# Altium project Sitara.PrjPCB (part 1 of 2)
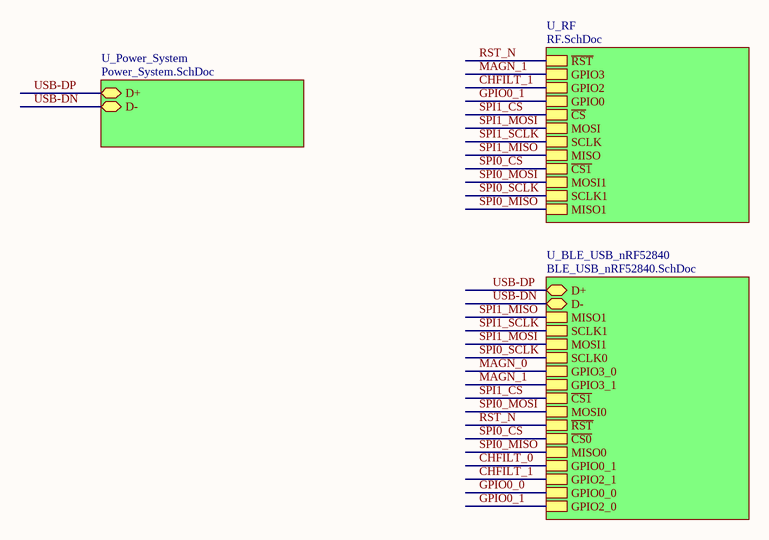
[diagram p0: _Block_level_sheet.SchDoc]
4 sheets, 109 parts. Net scope: hierarchical (ports join the sheet entries above them; power ports are global).
Board files: sitara_rev1.PcbDoc, sitara_rev2.PcbDoc, sitara_rev3.PcbDoc, sitara_rev3b.PcbDoc
Sheets:
  _Block_level_sheet.SchDoc
    U_Power_System = Power_System.SchDoc
    U_BLE_USB_nRF52840 = BLE_USB_nRF52840.SchDoc
    U_RF = RF.SchDoc

## Sheet _Block_level_sheet.SchDoc: Sitara
size A4; CompanyName: SPAN; Engineer: Goverdhan; Organization: University of Utah; Address1: 50 S Central Campus Dr; Address2: MEB Rm 3129; Address3: Salt Lake City, Utah 84115; Address4: USA; Revision: 1; SheetNumber: 1; SheetTotal: 4

### Sub-sheets
U_BLE_USB_nRF52840 = BLE_USB_nRF52840.SchDoc: D+ (bidir), D- (bidir), MISO1, SCLK1, MOSI1, SCLK0, GPIO3_0, GPIO3_1, ~{CS1}, MOSI0, ~{RST}, ~{CS0}, MISO0, GPIO0_1, GPIO2_1, GPIO0_0, GPIO2_0
U_Power_System = Power_System.SchDoc: D+ (bidir), D- (bidir)
U_RF = RF.SchDoc: ~{CS1}, MISO1, MOSI1, SCLK1, GPIO3, GPIO2, MISO, GPIO0, ~{CS}, ~{RST}, SCLK, MOSI

### Nets
CHFILT_1: sheet U_BLE_USB_nRF52840/GPIO2_1, sheet U_RF/GPIO2
GPIO0_1: sheet U_BLE_USB_nRF52840/GPIO2_0, sheet U_RF/GPIO0
MAGN_1: sheet U_BLE_USB_nRF52840/GPIO3_1, sheet U_RF/GPIO3
RST_N: sheet U_BLE_USB_nRF52840/~{RST}, sheet U_RF/~{RST}
SPI0_CS: sheet U_BLE_USB_nRF52840/~{CS0}, sheet U_RF/~{CS1}
SPI0_MISO: sheet U_BLE_USB_nRF52840/MISO0, sheet U_RF/MISO1
SPI0_MOSI: sheet U_BLE_USB_nRF52840/MOSI0, sheet U_RF/MOSI1
SPI0_SCLK: sheet U_BLE_USB_nRF52840/SCLK0, sheet U_RF/SCLK1
SPI1_CS: sheet U_BLE_USB_nRF52840/~{CS1}, sheet U_RF/~{CS}
SPI1_MISO: sheet U_BLE_USB_nRF52840/MISO1, sheet U_RF/MISO
SPI1_MOSI: sheet U_BLE_USB_nRF52840/MOSI1, sheet U_RF/MOSI
SPI1_SCLK: sheet U_BLE_USB_nRF52840/SCLK1, sheet U_RF/SCLK
USB-DN: sheet U_Power_System/D-, sheet U_BLE_USB_nRF52840/D-  [project net D1_N]
USB-DP: sheet U_Power_System/D+, sheet U_BLE_USB_nRF52840/D+  [project net D1_P]

### Notes on the sheet
- Title
- Designed by:
- Date:
- Time:
- Revision:
- Sheet
- of
- File:

## Sheet Power_System.SchDoc
size A4; CompanyName: SPAN; Engineer: Goverdhan; Organization: University of Utah; Address1: 50 S Central Campus Dr; Address2: MEB Rm 3129; Address3: Salt Lake City, Utah 84115; Address4: USA; Revision: 1; SheetNumber: 2; SheetTotal: 4
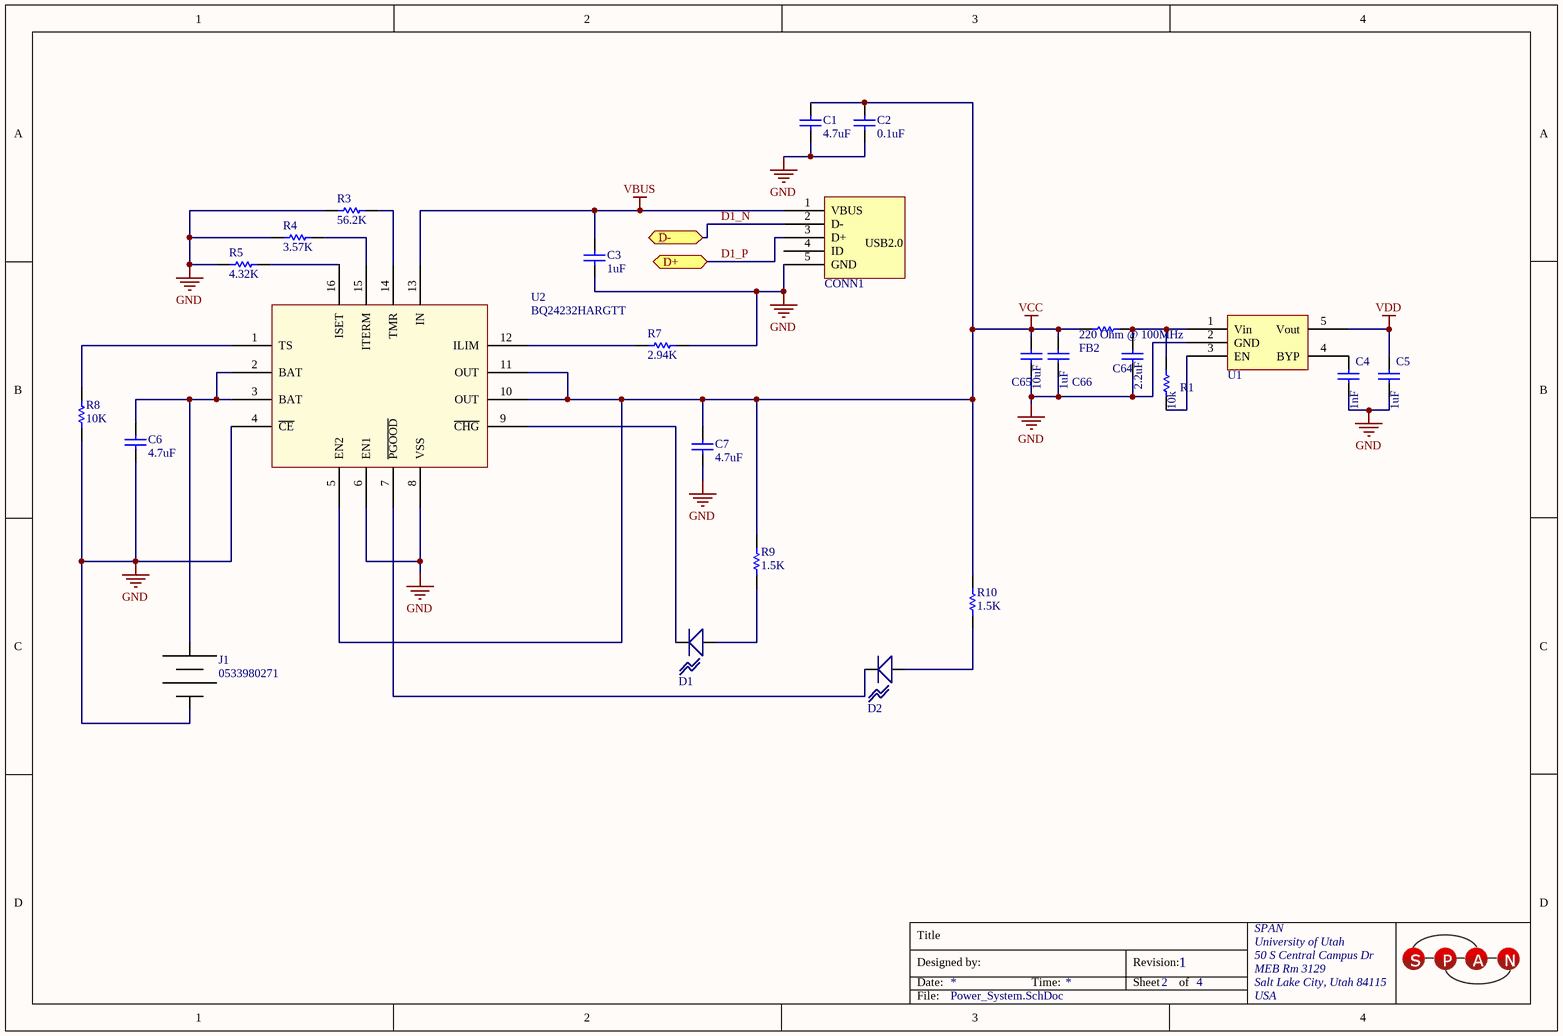
[diagram p1: Power_System.SchDoc]

### Parts
C1  4.7uF  [0603_Cap]
C2  0.1uF  [0603_Cap]
C3  1uF  [0603_Cap]
C4  10uF  [0603_Cap]  (value not drawn)
C5  GRM188R61A105KA61D  [CAPC1608X08N (0603)]  (value not drawn)
C6  4.7uF  [0603_Cap]
C7  4.7uF  [0603_Cap]
C64  GRM188F51A225ZE01D  [CAPC1608X08N (0603)]  (value not drawn)
C65  GRM188R60J106ME47D  [CAPC1608X08N (0603)]  (value not drawn)
C66  GRM188R61A105KA61D  [CAPC1608X08N (0603)]  (value not drawn)
CONN1  10118193-0001LF  [USB_micro_B]  (value not drawn)
D1  LTST-C191KFKT  [0603_LED]  (value not drawn)
D2  LTST-C191KFKT  [0603_LED]  (value not drawn)
FB2  BLM18BD221SN1D  [RESC1608X06N (0603)]  (value not drawn)
J1  0533980271  [53398-0271]
R1  10K  [0603_RES]  (value not drawn)
R3  56.2K  [0603_RES]
R4  3.57K  [0603_RES]
R5  4.32K  [0603_RES]
R7  2.94K  [0603_RES]
R8  10K  [0603_RES]
R9  1.5K  [0603_RES]
R10  1.5K  [0603_RES]
U1  TPS2147IDGQG4  [SOT95P280X145-5N]  (value not drawn)
U2  BQ24232HARGTT  [QFN_16_BQ24232]

### Ports
D+ (bidir), D- (bidir)

### Nets
GND: C1.1 C2.1 C3.1 C4.1 C5.1 C6.1 C7.1 C64.1 C65.1 C66.1 CONN1.5(GND) J1.2(Neg) R3.1 R4.1 R5.1 R7.2 R8.1 U1.2(GND) U2.4(~{CE}) U2.6(EN1) U2.8(VSS)
VBUS: C3.2 CONN1.1(VBUS) U2.13(IN)
VCC: C1.2 C2.2 C7.2 C65.2 C66.2 FB2.1 R9.2 R10.2 U2.5(EN2) U2.10(OUT) U2.11(OUT)
VDD: C5.2 U1.5(Vout)
D1_N: CONN1.2(D-) ; port D-
D1_P: CONN1.3(D+) ; port D+
NetC4_2: C4.2 U1.4(BYP)
NetC6_2: C6.2 J1.1(Pos) U2.2(BAT) U2.3(BAT)
NetC64_2: C64.2 FB2.2 R1.2 U1.1(Vin)
NetD1_1: D1.1 R9.1
NetD1_2: D1.2 U2.9(~{CHG})
NetD2_1: D2.1 R10.1
NetD2_2: D2.2 U2.7(~{PGOOD})
NetR1_1: R1.1 U1.3(EN)
NetR3_2: R3.2 U2.14(TMR)
NetR4_2: R4.2 U2.15(ITERM)
NetR5_2: R5.2 U2.16(ISET)
NetR7_1: R7.1 U2.12(ILIM)
NetR8_2: R8.2 U2.1(TS)

Not connected (* = marked no-connect by the designer): CONN1 4(ID)

### Notes on the sheet
- Title
- Designed by:
- Date:
- Time:
- Revision:
- Sheet
- of
- File:
- (in symbol 10118193-0001LF) USB2.0
- (in symbol GRM188F51A225ZE01D) 2.2uF
- (in symbol GRM188R60J106ME47D) 10uF
- (in symbol GRM188R61A105KA61D) 1uF
- (in symbol GRM1885C1H102JA01D) 1nF

### Library data of the parts
C1 C6 C7 = JMK107BJ475MAHT: Manufacturer: Taiyo Yuden; Capacitance: 4.7µF; Tolerance: ±20%; Voltage - Rated: 6.3V; Temperature Coefficient: X5R; Supplier 1: Digi-Key; Manufacturer Part Number: JMK107BJ475MAHT; RoHS: RoHS Compliant; Category: Capacitors; Stock 1: 4000; Pricing 1: 4000=0.03053, 8000=0.0284, 12000=0.02698, 28000=0.02556, 100000=0.01935 (USD); Packaging: Tape & Reel (TR); Part Status: Active; Operating Temperature: -55°C ~ 85°C; Features: -; Ratings: AEC-Q200; Applications: Automotive, SMPS Filtering; Failure Rate: -; Mounting Type: Surface Mount, MLCC; Package / Case: 0603 (1608 Metric); Size / Dimension: 0.063" L x 0.031" W (1.60mm x 0.80mm); Height - Seated (Max): -; Thickness (Max): 0.035" (0.90mm); Lead Spacing: -; Lead Style: -; ComponentLink1URL: http://www.yuden.co.jp/productdata/catalog/en/mlcc_all_hq_e.pdf; ComponentLink1Description: http://www.yuden.co.jp/productdata/catalog/en/mlcc_all_hq_e.pdf; Supplier Part Number 1: 587-4903-2-ND
C2 = 0603YC104KAT4A: CAP CER 0.1UF 16V X7R 0603; Manufacturer: AVX Corporation; Capacitance: 0.1µF; Tolerance: ±10%; Supplier 1: Digi-Key; Manufacturer Part Number: 0603YC104KAT4A; RoHS: RoHS Compliant; Category: Capacitors; Stock 1: 15000; Pricing 1: 15000=0.00344, 30000=0.00327, 75000=0.00292, 105000=0.00237 (USD); Packaging: Tape & Reel (TR); Part Status: Active; Voltage - Rated: 16V; Temperature Coefficient: X7R; Operating Temperature: -55°C ~ 125°C; Features: -; Ratings: -; Applications: General Purpose; Failure Rate: -; Mounting Type: Surface Mount, MLCC; Package / Case: 0603 (1608 Metric); Size / Dimension: 0.063" L x 0.032" W (1.60mm x 0.81mm); Height - Seated (Max): -; Thickness (Max): 0.035" (0.90mm); Lead Spacing: -; Lead Style: -; ComponentLink1URL: http://datasheets.avx.com/X7RDielectric.pdf; ComponentLink1Description: http://datasheets.avx.com/X7RDielectric.pdf; Supplier Part Number 1: 478-10054-2-ND
C3 = JMK107C6105KA-T: CAP CER 1uF SMD; Manufacturer: Taiyo Yuden; Capacitance: 1µF; Tolerance: ±10%; Voltage - Rated: 6.3V; Temperature Coefficient: X6S; Supplier 1: Digi-Key; Manufacturer Part Number: JMK107C6105KA-T; RoHS: RoHS Compliant; Category: Capacitors; Stock 1: 8000; Pricing 1: 4000=0.02281, 8000=0.02122, 12000=0.02016, 28000=0.0191, 100000=0.01446 (USD); Packaging: Tape & Reel (TR); Part Status: Active; Operating Temperature: -55°C ~ 105°C; Features: -; Ratings: -; Applications: SMPS Filtering; Failure Rate: -; Mounting Type: Surface Mount, MLCC; Package / Case: 0603 (1608 Metric); Size / Dimension: 0.063" L x 0.031" W (1.60mm x 0.80mm); Height - Seated (Max): -; Thickness (Max): 0.035" (0.90mm); Lead Spacing: -; Lead Style: -; ComponentLink1URL: http://www.yuden.co.jp/productdata/catalog/en/mlcc_all_e.pdf; ComponentLink1Description: http://www.yuden.co.jp/productdata/catalog/en/mlcc_all_e.pdf; Supplier Part Number 1: 587-4904-2-ND
C4 = GRM1885C1H102JA01D: CAP CER 1000PF 50V 5% NP0 0603; Manufacturer: Murata Electronics North America; Temperature Coefficient: C0G, NP0; Supplier 1: Digi-Key; Manufacturer Part Number: GRM1885C1H102JA01D; RoHS: RoHS Compliant; Category: Capacitors; Stock 1: 140000; Pricing 1: 4000=0.00863, 8000=0.00788, 12000=0.0075, 28000=0.00713, 100000=0.00516 (USD); Packaging: Tape & Reel (TR); Capacitance: 1000pF; Voltage - Rated: 50V; Tolerance: ±5%; Mounting Type: Surface Mount, MLCC; Operating Temperature: -55°C ~ 125°C; Applications: General Purpose; Ratings: -; Package / Case: 0603 (1608 Metric); Size / Dimension: 0.063" L x 0.031" W (1.60mm x 0.80mm); Height - Seated (Max): -; Thickness (Max): 0.035" (0.90mm); Lead Spacing: -; Features: -; Lead Style: -; ComponentLink1URL: http://www.murata.com/products/catalog/pdf/c02e.pdf; ComponentLink1Description: http://www.murata.com/products/catalog/pdf/c02e.pdf
C5 C66 = GRM188R61A105KA61D: CAP CER 1UF 10V 10% X5R 0603; Manufacturer: Murata Electronics North America; Capacitance: 1.0µF; Supplier 1: Digi-Key; Manufacturer Part Number: GRM188R61A105KA61D; RoHS: RoHS Compliant; Category: Capacitors; Stock 1: 244919; Pricing 1: 1=0.1, 10=0.041, 50=0.0224, 100=0.019, 250=0.01552, 500=0.01328, 1000=0.01035 (USD); Packaging: Cut Tape (CT); Voltage - Rated: 10V; Tolerance: ±10%; Temperature Coefficient: X5R; Mounting Type: Surface Mount, MLCC; Operating Temperature: -55°C ~ 85°C; Applications: General Purpose; Ratings: -; Package / Case: 0603 (1608 Metric); Size / Dimension: 0.063" L x 0.031" W (1.60mm x 0.80mm); Height - Seated (Max): -; Thickness (Max): 0.035" (0.90mm); Lead Spacing: -; Features: -; Lead Style: -; ComponentLink1URL: http://search.murata.co.jp/Ceramy/image/img/A01X/G101/ENG/GRM188R61A105KA61-01.pdf; ComponentLink1Description: http://search.murata.co.jp/Ceramy/image/img/A01X/G101/ENG/GRM188R61A105KA61-01.pdf
C64 = GRM188F51A225ZE01D: CAP CER 2.2UF 10V Y5V 0603; Manufacturer: Murata Electronics North America; Capacitance: 2.2µF; Tolerance: -20%, +80%; Temperature Coefficient: Y5V (F); Supplier 1: Digi-Key; Manufacturer Part Number: GRM188F51A225ZE01D; RoHS: RoHS Compliant; Category: Capacitors; Stock 1: 8000; Pricing 1: 4000=0.02043, 8000=0.019, 12000=0.01805, 28000=0.0171 (USD); Packaging: Tape & Reel (TR); Voltage - Rated: 10V; Mounting Type: Surface Mount, MLCC; Operating Temperature: -30°C ~ 85°C; Applications: General Purpose; Ratings: -; Package / Case: 0603 (1608 Metric); Size / Dimension: 0.063" L x 0.031" W (1.60mm x 0.80mm); Height - Seated (Max): -; Thickness (Max): 0.035" (0.90mm); Lead Spacing: -; Features: -; Lead Style: -; ComponentLink1URL: http://search.murata.co.jp/Ceramy/image/img/A01X/G101/ENG/GRM188F51A225ZE01-01.pdf; ComponentLink1Description: http://search.murata.co.jp/Ceramy/image/img/A01X/G101/ENG/GRM188F51A225ZE01-01.pdf
C65 = GRM188R60J106ME47D: CAP CER 10UF 6.3V 20% X5R 0603; Manufacturer: Murata Electronics North America; Capacitance: 10µF; Supplier 1: Digi-Key; Manufacturer Part Number: GRM188R60J106ME47D; RoHS: RoHS Compliant; Category: Capacitors; Stock 1: 2128324; Pricing 1: 1=0.24, 10=0.2, 50=0.1126, 100=0.1, 250=0.075, 500=0.06626, 1000=0.05875 (USD); Packaging: Digi-Reel®; Voltage - Rated: 6.3V; Tolerance: ±20%; Temperature Coefficient: X5R; Mounting Type: Surface Mount, MLCC; Operating Temperature: -55°C ~ 85°C; Applications: General Purpose; Ratings: -; Package / Case: 0603 (1608 Metric); Size / Dimension: 0.063" L x 0.031" W (1.60mm x 0.80mm); Height - Seated (Max): -; Thickness (Max): 0.035" (0.90mm); Lead Spacing: -; Features: -; Lead Style: -; ComponentLink1URL: http://search.murata.co.jp/Ceramy/image/img/A01X/G101/ENG/GRM188R60J106ME47-01.pdf; ComponentLink1Description: http://search.murata.co.jp/Ceramy/image/img/A01X/G101/ENG/GRM188R60J106ME47-01.pdf; Supplier 2: Digi-Key
CONN1 = 10118193-0001LF: CONN USB MICRO B RECPT SMT R/A; Manufacturer: Amphenol FCI; Connector Type: USB - micro B; Number of Contacts: 5; Gender: Receptacle; Specifications: USB 2.0; Number of Ports: 1; Current Rating: 1.8A per Contact; Voltage - Rated: 100VAC; Mating Cycles: 10000; Shielding: Shielded; Material Flammability Rating: UL94 V-0; Supplier 1: Digi-Key; Manufacturer Part Number: 10118193-0001LF; RoHS: RoHS Compliant; Category: Connectors, Interconnects; Stock 1: 88800; Pricing 1: 1200=0.19845, 2400=0.18144, 6000=0.1701, 8400=0.15876, 12000=0.15309, 30000=0.15082, 60000=0.14742 (USD); Packaging: Tape & Reel (TR); Part Status: Active; Mounting Type: Surface Mount, Right Angle; Through Hole; Mounting Feature: Horizontal; Termination: Solder; Features: Solder Retention; Ingress Protection: -; Operating Temperature: -30°C ~ 80°C; Contact Finish: Gold; Shell/Shielding Material: Steel, Stainless; Insulation Color: Black; ComponentLink1URL: http://portal.fciconnect.com/Comergent//fci/drawing/10118193.pdf; ComponentLink1Description: http://portal.fciconnect.com/Comergent//fci/drawing/10118193.pdf; Supplier Part Number 1: 609-4616-2-ND
D1 D2 = LTST-C191KFKT: LED ORANGE CLEAR 0603 SMD; Manufacturer: Lite-On Inc.; Lens Color: Colorless; Millicandela Rating: 90mcd; Lens Style/Size: Rectangle with Flat Top, 1.10mm x 0.80mm; Voltage - Forward (Vf) (Typ): 2V; Current - Test: 20mA; Viewing Angle: 130°; Wavelength - Dominant: 605nm; Wavelength - Peak: 611nm; Supplier 1: Digi-Key; Manufacturer Part Number: LTST-C191KFKT; RoHS: RoHS Compliant; Category: Optoelectronics; Stock 1: 160000; Pricing 1: 5000=0.0376, 10000=0.03384, 25000=0.03008, 50000=0.02726, 125000=0.02538 (USD); Packaging: Tape & Reel (TR); Part Status: Active; Color: Orange; Lens Transparency: Clear; Mounting Type: Surface Mount; Features: -; Package / Case: 0603 (1608 Metric); Size / Dimension: 1.60mm L x 0.80mm W; Height (Max): 0.55mm; ComponentLink1URL: http://optoelectronics.liteon.com/upload/download/DS22-2000-222/S_110_LTST-C191KFKT.pdf; ComponentLink1Description: http://optoelectronics.liteon.com/upload/download/DS22-2000-222/S_110_LTST-C191KFKT.pdf; Supplier Part Number 1: 160-1445-2-ND
FB2 = BLM18BD221SN1D: FERRITE CHIP 220 OHM 200MA 0603; Manufacturer: Murata Electronics North America; Impedance @ Frequency: 220 Ohm @ 100MHz; DC Resistance (DCR): 450 mOhm Max; Filter Type: Differential Mode - Single; Supplier 1: Digi-Key; Manufacturer Part Number: BLM18BD221SN1D; RoHS: RoHS Compliant; Category: Filters; Stock 1: 35645; Pricing 1: 1=0.1, 10=0.087, 50=0.0712, 100=0.0523, 250=0.038, 500=0.03484, 1000=0.0301 (USD); Packaging: Cut Tape (CT); Current Rating: 200mA; Package / Case: 0603 (1608 Metric); Mounting Type: Surface Mount; Height (Max): 0.037" (0.95mm); Size / Dimension: 0.063" L x 0.031" W (1.60mm x 0.80mm); ComponentLink1URL: http://search.murata.co.jp/Ceramy/image/img/PDF/ENG/L0110S0100BLM18B.pdf; ComponentLink1Description: http://search.murata.co.jp/Ceramy/image/img/PDF/ENG/L0110S0100BLM18B.pdf
J1 = 0533980271: CONN HEADER 2POS 1.25MM VERT SMD; Manufacturer: Molex Inc; Connector Type: Header, Male Blades; Number of Positions: 2; Pitch: 0.049" (1.25mm); Supplier 1: Digi-Key; RoHS: RoHS Compliant; Category: Connectors, Interconnects; Stock 1: 14126; Pricing 1: 1=1.4, 10=1.091, 25=1.0168, 50=0.923, 100=0.8323, 250=0.7014, 500=0.66448 (USD); Connector Style: -; Mounting Type: Surface Mount; Termination: Solder; Wire Gauge: -; Features: -; Color: Natural; Packaging: Cut Tape (CT); ComponentLink1URL: http://www.molex.com/pdm_docs/sd/533980271_sd.pdf; ComponentLink1Description: http://www.molex.com/pdm_docs/sd/533980271_sd.pdf; Supplier Part Number 1: WM7606CT-ND; Manufacturer Part Number: 0533980271
R1 = RC0603FR-0710KL: RES 10.0K OHM 1/10W 1% 0603 SMD; Manufacturer: Yageo; Power (Watts): 0.1W, 1/10W; Temperature Coefficient: ±100ppm/°C; Supplier 1: Digi-Key; Manufacturer Part Number: RC0603FR-0710KL; RoHS: RoHS Compliant; Category: Resistors; Stock 1: 11245000; Pricing 1: 5000=0.00171, 10000=0.00149, 25000=0.00131, 50000=0.0012, 125000=0.00117 (USD); Packaging: Tape & Reel (TR); Resistance (Ohms): 10k; Tolerance: ±1%; Composition: Thick Film; Features: -; Package / Case: 0603 (1608 Metric); Supplier Device Package: 0603; Size / Dimension: 0.063" L x 0.031" W (1.60mm x 0.80mm); Height: 0.022" (0.55mm); Number of Terminations: 2; ComponentLink1URL: http://www.yageo.com/documents/recent/PYu-RC0603_51_RoHS_L_4.pdf; ComponentLink1Description: http://www.yageo.com/documents/recent/PYu-RC0603_51_RoHS_L_4.pdf
R3 = ERA-3AEB5622V: RES SMD 56.2KOHM 0.1% 1/10W 0603; Manufacturer: Panasonic Electronic Components; Power (Watts): 0.1W, 1/10W; Temperature Coefficient: ±25ppm/°C; Supplier 1: Digi-Key; Manufacturer Part Number: ERA-3AEB5622V; RoHS: RoHS Compliant; Category: Resistors; Stock 1: 5000; Pricing 1: 5000=0.0354, 10000=0.03304, 25000=0.03139, 50000=0.03075, 125000=0.03009 (USD); Packaging: Tape & Reel (TR); Part Status: Active; Resistance (Ohms): 56.2k; Tolerance: ±0.1%; Composition: Thin Film; Features: Automotive AEC-Q200; Operating Temperature: -55°C ~ 155°C; Package / Case: 0603 (1608 Metric); Supplier Device Package: 0603; Size / Dimension: 0.063" L x 0.031" W (1.60mm x 0.80mm); Height - Seated (Max): 0.022" (0.55mm); Number of Terminations: 2; Failure Rate: -; ComponentLink1URL: https://industrial.panasonic.com/cdbs/www-data/pdf/RDA0000/AOA0000C237.pdf; ComponentLink1Description: https://industrial.panasonic.com/cdbs/www-data/pdf/RDA0000/AOA0000C237.pdf; Supplier Part Number 1: P56.2KDBTR-ND
R4 = TNPW06033K57BEEA: RES SMD 3.57KOHM 0.1% 1/10W 0603; Manufacturer: Vishay Dale; Power (Watts): 0.1W, 1/10W; Temperature Coefficient: ±25ppm/°C; Supplier 1: Digi-Key; Manufacturer Part Number: TNPW06033K57BEEA; RoHS: RoHS Compliant; Category: Resistors; Stock 1: 0; Pricing 1: 5000=0.1064 (USD); Packaging: Tape & Reel (TR); Part Status: Active; Resistance (Ohms): 3.57k; Tolerance: ±0.1%; Composition: Thin Film; Features: Anti-Sulfur, Automotive AEC-Q200, Moisture Resistant; Operating Temperature: -55°C ~ 125°C; Package / Case: 0603 (1608 Metric); Supplier Device Package: 0603; Size / Dimension: 0.063" L x 0.033" W (1.60mm x 0.85mm); Height - Seated (Max): 0.022" (0.55mm); Number of Terminations: 2; Failure Rate: -; ComponentLink1URL: http://www.vishay.com/docs/28758/tnpw_e3.pdf; ComponentLink1Description: http://www.vishay.com/docs/28758/tnpw_e3.pdf; Supplier Part Number 1: TNPW06033K57BEEA-ND
R5 = ERA-3AEB4321V: RES SMD 4.32KOHM 0.1% 1/10W 0603; Manufacturer: Panasonic Electronic Components; Power (Watts): 0.1W, 1/10W; Temperature Coefficient: ±25ppm/°C; Supplier 1: Digi-Key; Manufacturer Part Number: ERA-3AEB4321V; RoHS: RoHS Compliant; Category: Resistors; Stock 1: 5000; Pricing 1: 5000=0.0354, 10000=0.03304, 25000=0.03139, 50000=0.03075, 125000=0.03009 (USD); Packaging: Tape & Reel (TR); Part Status: Active; Resistance (Ohms): 4.32k; Tolerance: ±0.1%; Composition: Thin Film; Features: Automotive AEC-Q200; Operating Temperature: -55°C ~ 155°C; Package / Case: 0603 (1608 Metric); Supplier Device Package: 0603; Size / Dimension: 0.063" L x 0.031" W (1.60mm x 0.80mm); Height - Seated (Max): 0.022" (0.55mm); Number of Terminations: 2; Failure Rate: -; ComponentLink1URL: https://industrial.panasonic.com/cdbs/www-data/pdf/RDA0000/AOA0000C237.pdf; ComponentLink1Description: https://industrial.panasonic.com/cdbs/www-data/pdf/RDA0000/AOA0000C237.pdf; Supplier Part Number 1: P4.32KDBTR-ND
R7 = ERA-3AEB2941V: RES SMD 2.94KOHM 0.1% 1/10W 0603; Manufacturer: Panasonic Electronic Components; Power (Watts): 0.1W, 1/10W; Temperature Coefficient: ±25ppm/°C; Supplier 1: Digi-Key; Manufacturer Part Number: ERA-3AEB2941V; RoHS: RoHS Compliant; Category: Resistors; Stock 1: 10000; Pricing 1: 5000=0.0354, 10000=0.03304, 25000=0.03139, 50000=0.03075, 125000=0.03009 (USD); Packaging: Tape & Reel (TR); Part Status: Active; Resistance (Ohms): 2.94k; Tolerance: ±0.1%; Composition: Thin Film; Features: Automotive AEC-Q200; Operating Temperature: -55°C ~ 155°C; Package / Case: 0603 (1608 Metric); Supplier Device Package: 0603; Size / Dimension: 0.063" L x 0.031" W (1.60mm x 0.80mm); Height - Seated (Max): 0.022" (0.55mm); Number of Terminations: 2; Failure Rate: -; ComponentLink1URL: https://industrial.panasonic.com/cdbs/www-data/pdf/RDA0000/AOA0000C237.pdf; ComponentLink1Description: https://industrial.panasonic.com/cdbs/www-data/pdf/RDA0000/AOA0000C237.pdf; Supplier Part Number 1: P2.94KDBTR-ND
R8 = PHT0603Y1002BGT200: RES SMD 10KOHM 0.1% 0.0375W 0603; Manufacturer: Vishay Sfernice; Temperature Coefficient: ±15ppm/°C; Supplier 1: Digi-Key; Manufacturer Part Number: PHT0603Y1002BGT200; RoHS: RoHS Compliant; Category: Resistors; Stock 1: 400; Pricing 1: 200=6.6496, 400=6.0262, 600=5.6106, 1000=5.195 (USD); Packaging: Tape & Reel (TR); Part Status: Active; Resistance (Ohms): 10k; Tolerance: ±0.1%; Power (Watts): 0.0375W; Composition: Thin Film; Features: Anti-Sulfur; Operating Temperature: -55°C ~ 215°C; Package / Case: 0603 (1608 Metric); Supplier Device Package: 0603; Size / Dimension: 0.060" L x 0.033" W (1.52mm x 0.85mm); Height - Seated (Max): 0.025" (0.64mm); Number of Terminations: 2; Failure Rate: -; ComponentLink1URL: http://www.vishay.com/docs/53050/pht.pdf; ComponentLink1Description: http://www.vishay.com/docs/53050/pht.pdf; Supplier Part Number 1: PHTB-10KTR-ND
R9 R10 = CRCW06031K50JNEA: RES SMD 1.5K OHM 5% 1/10W 0603; Manufacturer: Vishay Dale; Power (Watts): 0.1W, 1/10W; Temperature Coefficient: ±200ppm/°C; Supplier 1: Digi-Key; Manufacturer Part Number: CRCW06031K50JNEA; RoHS: RoHS Compliant; Category: Resistors; Stock 1: 30000; Pricing 1: 5000=0.00266, 10000=0.00231, 25000=0.00203, 50000=0.0019 (USD); Packaging: Tape & Reel (TR); Part Status: Active; Resistance (Ohms): 1.5k; Tolerance: ±5%; Composition: Thick Film; Features: Automotive AEC-Q200; Operating Temperature: -55°C ~ 155°C; Package / Case: 0603 (1608 Metric); Supplier Device Package: 0603; Size / Dimension: 0.063" L x 0.033" W (1.60mm x 0.85mm); Height - Seated (Max): 0.020" (0.50mm); Number of Terminations: 2; Failure Rate: -; ComponentLink1URL: http://www.vishay.com/docs/20035/dcrcwe3.pdf; ComponentLink1Description: http://www.vishay.com/docs/20035/dcrcwe3.pdf; Supplier Part Number 1: 541-1.5KGTR-ND
U1 = FAN2500S30X: IC REG LDO 3V 0.1A SOT23-5; Manufacturer: Fairchild Semiconductor; Regulator Topology: Positive Fixed; Current - Output: 100mA; Voltage - Dropout (Typical): 0.1V @ 100mA; Number of Regulators: 1; Voltage - Input: Up to 6.5V; Supplier 1: Digi-Key; Manufacturer Part Number: FAN2500S30X; RoHS: RoHS Compliant; Category: Integrated Circuits (ICs); Stock 1: 6000; Pricing 1: 3000=0.25462, 6000=0.23706, 15000=0.22828, 30000=0.2195, 75000=0.21599, 150000=0.21072 (USD); Packaging: Tape & Reel (TR); Voltage - Output: 3V; Current - Limit (Min): -; Operating Temperature: -40°C ~ 125°C; Mounting Type: Surface Mount; Package / Case: SC-74A, SOT-753; Supplier Device Package: SOT-23-5; ComponentLink1URL: http://www.fairchildsemi.com/ds/FA/FAN2500.pdf; ComponentLink1Description: http://www.fairchildsemi.com/ds/FA/FAN2500.pdf
U2 = BQ24232HARGTT: IC LI-ION CHARGE PWR MGMT 16VQFN; Manufacturer: Texas Instruments; Battery Chemistry: Lithium-Ion; Number of Cells: 1; Current - Charging: Constant - Programmable; Programmable Features: Current, Timer; Fault Protection: Over Temperature, Over Voltage, Reverse Current, Short Circuit; Charge Current - Max: 500mA; Battery Pack Voltage: 4.2V; Voltage - Supply (Max): 10.2V; Interface: USB; Supplier 1: Digi-Key; RoHS: RoHS Compliant; Category: Integrated Circuits (ICs); Stock 1: 0; Pricing 1: 250=2.09792, 500=1.88244, 1250=1.5876 (USD); Packaging: Tape & Reel (TR); Part Status: Active; Operating Temperature: -5°C ~ 125°C (TJ); Package / Case: 16-VFQFN Exposed Pad; Supplier Device Package: 16-QFN (3x3); ComponentLink1URL: http://www.ti.com/lit/ds/symlink/bq24232ha.pdf; ComponentLink1Description: http://www.ti.com/lit/ds/symlink/bq24232ha.pdf; Supplier Part Number 1: 296-44194-2-ND; Manufacturer Part Number: BQ24232HARGTT

## Sheet BLE_USB_nRF52840.SchDoc: nRF52840
size A4; CompanyName: SPAN; Engineer: Anh Luong; Organization: University of Utah; Address1: 50 S Central Campus Dr; Address2: MEB Rm 3129; Address3: Salt Lake City, Utah 84115; Address4: USA; Revision: 1; SheetNumber: 2; SheetTotal: 5
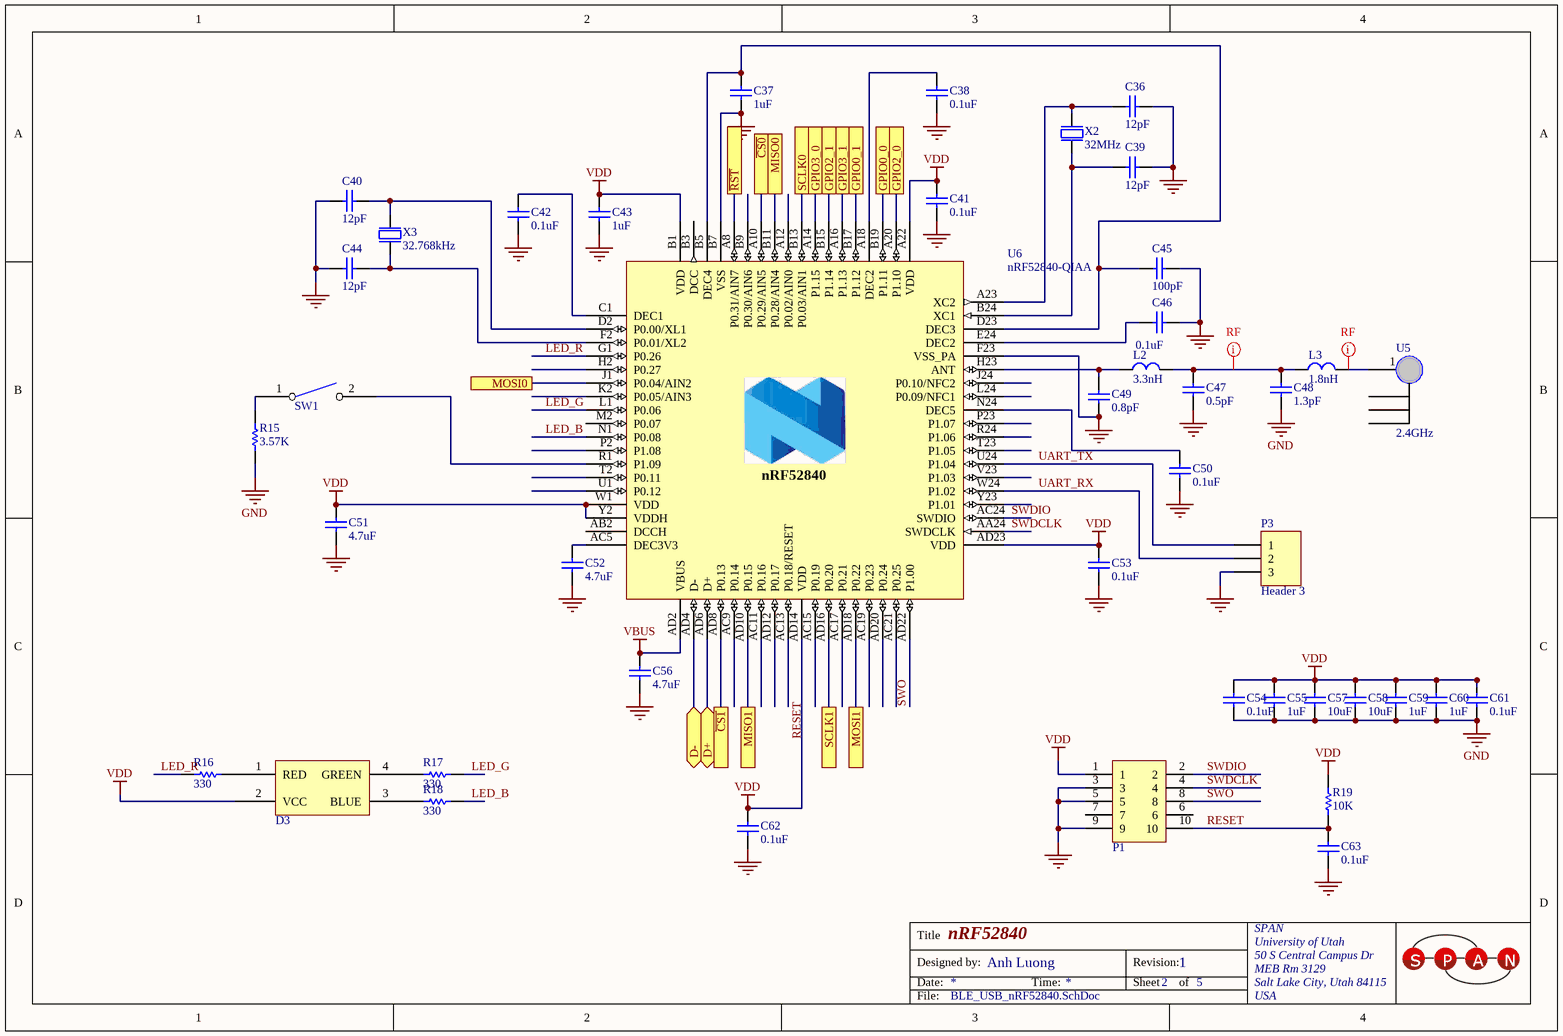
[diagram p2: BLE_USB_nRF52840.SchDoc]

### Parts
C36  12pF  [0603_Cap]
C37  1uF  [0603_Cap]
C38  0.1uF  [0603_Cap]
C39  12pF  [0603_Cap]
C40  12pF  [0603_Cap]
C41  0.1uF  [0603_Cap]
C42  0.1uF  [0603_Cap]
C43  1uF  [0603_Cap]
C44  12pF  [0603_Cap]
C45  100pF  [0603_Cap]
C46  0.1uF  [0603_Cap]
C47  0.5pF  [0603_Cap]
C48  1.3pF  [0603_Cap]
C49  0.8pF  [0603_Cap]
C50  0.1uF  [0603_Cap]
C51  4.7uF  [0603_Cap]
C52  4.7uF  [0603_Cap]
C53  0.1uF  [0603_Cap]
C54  0.1uF  [0603_Cap]
C55  1uF  [0603_Cap]
C56  4.7uF  [0603_Cap]
C57  10uF  [0603_Cap]
C58  10uF  [0603_Cap]
C59  1uF  [0603_Cap]
C60  1uF  [0603_Cap]
C61  0.1uF  [0603_Cap]
C62  0.1uF  [0603_Cap]
C63  0.1uF  [0603_Cap]
D3  CLV1A-FKB-CJ1M1F1BB7R4S3  [CREE LV1]  (value not drawn)
L2  3.3nH  [0603_IND]
L3  1.8nH  [0603_IND]
P1  M50-3500542  [M50]  (value not drawn)
P3  Header 3  [HDR1X3]
R15  3.57K  [0603_RES]
R16  330  [0603_RES]
R17  330  [0603_RES]
R18  330  [0603_RES]
R19  10K  [0603_RES]
SW1  EVQ-PE105K  [EVQ-PE105K]  (value not drawn)
U5  2.4GHz  [ANT_molex_2_4_GHz]
U6  nRF52840-QIAA  [AQFN50P700X700X85_HS-74N]
X2  32MHz  [BT-XTAL_2016]
X3  32.768kHz  [XTAL_3215]

### Ports
D+ (bidir), D- (bidir), GPIO0_0, GPIO0_1, GPIO2_0, GPIO2_1, GPIO3_0, GPIO3_1, MISO0, MISO1, MOSI0, MOSI1, SCLK0, SCLK1, ~{CS0}, ~{CS1}, ~{RST}

### Nets
GND: C36.2 C37.1 C38.2 C39.2 C40.1 C41.1 C42.1 C43.1 C44.1 C45.2 C46.1 C47.1 C48.1 C49.1 C50.2 C51.1 C52.1 C53.1 C54.1 C55.1 C56.1 C57.1 C58.1 C59.1 C60.1 C61.1 C62.1 C63.1 P1.3 P1.5 P1.9 P3.3 R15.1 U6.74(GND) U6.B7(VSS) U6.F23(VSS_PA) X2.2(GND) X2.4(GND)
VBUS: C56.2 U6.AD2(VBUS)
VDD: C41.2 C43.2 C51.2 C53.2 C54.2 C55.2 C57.2 C58.2 C59.2 C60.2 C61.2 C62.2 D3.2(VCC) P1.1 R19.1 U6.A22(VDD) U6.AD14(VDD) U6.AD23(VDD) U6.B1(VDD) U6.W1(VDD) U6.Y2(VDDH)
CHFILT_0: U6.B17(P1.12) ; port GPIO0_1
CHFILT_1: U6.B15(P1.14) ; port GPIO2_1
D1_N: U6.AD4(D-) ; port D-
D1_P: U6.AD6(D+) ; port D+
GPIO0_0: U6.B19(P1.11) ; port GPIO0_0
GPIO0_1: U6.A20(P1.10) ; port GPIO2_0
LED_B: R18.2 U6.N1(P0.08)
LED_G: R17.2 U6.L1(P0.06)
LED_R: R16.1 U6.G1(P0.26)
MAGN_0: U6.A14(P1.15) ; port GPIO3_0
MAGN_1: U6.A16(P1.13) ; port GPIO3_1
RESET: C63.2 P1.10 R19.2 U6.AC13(P0.18/RESET)
RST_N: U6.A8(P0.31/AIN7) ; port ~{RST}
SPI0_CS: U6.A10(P0.29/AIN5) ; port ~{CS0}
SPI0_MISO: U6.B11(P0.28/AIN4) ; port MISO0
SPI0_MOSI: U6.J1(P0.04/AIN2) ; port MOSI0
SPI0_SCLK: U6.B13(P0.03/AIN1) ; port SCLK0
SPI1_CS: U6.AD8(P0.13) ; port ~{CS1}
SPI1_MISO: U6.AD10(P0.15) ; port MISO1
SPI1_MOSI: U6.AD18(P0.22) ; port MOSI1
SPI1_SCLK: U6.AD16(P0.20) ; port SCLK1
SWDCLK: P1.4 U6.AA24(SWDCLK)
SWDIO: P1.2 U6.AC24(SWDIO)
SWO: P1.8 U6.AD22(P1.00)
UART_RX: P3.2 U6.W24(P1.02)
UART_TX: P3.1 U6.U24(P1.04)
NetC36_1: C36.1 U6.A23(XC2) X2.3(out)
NetC37_2: C37.2 C45.1 U6.B5(DEC4) U6.D23(DEC3)
NetC38_1: C38.1 U6.A18(DEC2)
NetC39_1: C39.1 U6.B24(XC1) X2.1(inp)
NetC40_2: C40.2 U6.D2(P0.00/XL1) X3.1(inp)
NetC42_2: C42.2 U6.C1(DEC1)
NetC44_2: C44.2 U6.F2(P0.01/XL2) X3.2(out)
NetC46_2: C46.2 U6.E24(DEC2)
NetC47_2: C47.2 C48.2 L2.2 L3.1
NetC49_2: C49.2 L2.1 U6.H23(ANT)
NetC50_1: C50.1 U6.N24(DEC5)
NetC52_2: C52.2 U6.AC5(DEC3V3)
NetD3_1: D3.1(RED) R16.2
NetD3_3: D3.3(BLUE) R18.1
NetD3_4: D3.4(GREEN) R17.1
NetL3_2: L3.2 U5.1
NetR15_2: R15.2 SW1.1
NetSW1_2: SW1.2 U6.R1(P1.09)

Not connected (* = marked no-connect by the designer): P1 6 7; U5 2 3 4; U6 A12(P0.02/AIN0) AB2(DCCH) AC9(P0.14) AC11(P0.16) AC15(P0.19) AC17(P0.21) AC19(P0.23) AC21(P0.25) AD12(P0.17) AD20(P0.24) B3(DCC) B9(P0.30/AIN6) H2(P0.27) J24(P0.10/NFC2) K2(P0.05/AIN3) L24(P0.09/NFC1) M2(P0.07) P2(P1.08) P23(P1.07) R24(P1.06) T2(P0.11) T23(P1.05) U1(P0.12) V23(P1.03) Y23(P1.01)

### Layout directives
net class RF: NetC47_2, NetL3_2

### Notes on the sheet
- Title
- Designed by:
- Date:
- Time:
- Revision:
- Sheet
- of
- File:
- (in symbol nRF52840_QIAA) nRF52840

### Library data of the parts
C36 C39 C40 C44 = 251R14S120GV4T: CAP CER 12PF 250V NP0 0603; Manufacturer: Johanson Technology Inc.; Tolerance: ±2%; Temperature Coefficient: C0G, NP0; Supplier 1: Digi-Key; Manufacturer Part Number: 251R14S120GV4T; RoHS: RoHS Compliant; Category: Capacitors; Stock 1: 32000; Pricing 1: 4000=0.1071, 8000=0.1008, 12000=0.09765, 28000=0.0945, 100000=0.0819 (USD); Packaging: Tape & Reel (TR); Part Status: Active; Capacitance: 12pF; Voltage - Rated: 250V; Operating Temperature: -55°C ~ 125°C; Features: High Q, Low Loss; Ratings: -; Applications: RF, Microwave, High Frequency; Mounting Type: Surface Mount, MLCC; Package / Case: 0603 (1608 Metric); Size / Dimension: 0.062" L x 0.032" W (1.57mm x 0.81mm); Height - Seated (Max): -; Thickness (Max): 0.035" (0.89mm); Lead Spacing: -; Lead Style: -; ComponentLink1URL: http://www.johansontechnology.com/downloads/JTI-CAT-MLCC-HighQ.pdf; ComponentLink1Description: http://www.johansontechnology.com/downloads/JTI-CAT-MLCC-HighQ.pdf; Supplier Part Number 1: 712-1313-2-ND
C37 C43 C55 C59 C60 = JMK107C6105KA-T: as C3 on sheet Power_System; Supplier 1: Digi-Key; Manufacturer Part Number: JMK107C6105KA-T; RoHS: RoHS Compliant; Category: Capacitors; Stock 1: 8000; Pricing 1: 4000=0.02281, 8000=0.02122, 12000=0.02016, 28000=0.0191, 100000=0.01446 (USD); Packaging: Tape & Reel (TR); Part Status: Active; Operating Temperature: -55°C ~ 105°C; Features: -; Ratings: -; Applications: SMPS Filtering; Failure Rate: -; Mounting Type: Surface Mount, MLCC; Package / Case: 0603 (1608 Metric); Size / Dimension: 0.063" L x 0.031" W (1.60mm x 0.80mm); Height - Seated (Max): -; Thickness (Max): 0.035" (0.90mm); Lead Spacing: -; Lead Style: -; ComponentLink1URL: http://www.yuden.co.jp/productdata/catalog/en/mlcc_all_e.pdf; ComponentLink1Description: http://www.yuden.co.jp/productdata/catalog/en/mlcc_all_e.pdf; Supplier Part Number 1: 587-4904-2-ND
C38 C41 C42 C46 C50 C53 C54 C61-C63 = 0603YC104KAT4A: as C2 on sheet Power_System; Supplier 1: Digi-Key; Manufacturer Part Number: 0603YC104KAT4A; RoHS: RoHS Compliant; Category: Capacitors; Stock 1: 15000; Pricing 1: 15000=0.00344, 30000=0.00327, 75000=0.00292, 105000=0.00237 (USD); Packaging: Tape & Reel (TR); Part Status: Active; Voltage - Rated: 16V; Temperature Coefficient: X7R; Operating Temperature: -55°C ~ 125°C; Features: -; Ratings: -; Applications: General Purpose; Failure Rate: -; Mounting Type: Surface Mount, MLCC; Package / Case: 0603 (1608 Metric); Size / Dimension: 0.063" L x 0.032" W (1.60mm x 0.81mm); Height - Seated (Max): -; Thickness (Max): 0.035" (0.90mm); Lead Spacing: -; Lead Style: -; ComponentLink1URL: http://datasheets.avx.com/X7RDielectric.pdf; ComponentLink1Description: http://datasheets.avx.com/X7RDielectric.pdf; Supplier Part Number 1: 478-10054-2-ND
C45 = C1608C0G1H101J080AA: CAP CER 100PF 50V C0G 0603; Manufacturer: TDK Corporation; Tolerance: ±5%; Temperature Coefficient: C0G, NP0; Supplier 1: Digi-Key; Manufacturer Part Number: C1608C0G1H101J080AA; RoHS: RoHS Compliant; Category: Capacitors; Stock 1: 2140000; Pricing 1: 4000=0.01301, 8000=0.01188, 12000=0.01131, 28000=0.01075, 100000=0.00778 (USD); Packaging: Tape & Reel (TR); Part Status: Not For New Designs; Capacitance: 100pF; Voltage - Rated: 50V; Operating Temperature: -55°C ~ 125°C; Features: Low ESL; Ratings: -; Applications: General Purpose; Failure Rate: -; Mounting Type: Surface Mount, MLCC; Package / Case: 0603 (1608 Metric); Size / Dimension: 0.063" L x 0.031" W (1.60mm x 0.80mm); Height - Seated (Max): -; Thickness (Max): 0.037" (0.95mm); Lead Spacing: -; Lead Style: -; ComponentLink1URL: https://product.tdk.com/info/en/catalog/datasheets/mlcc_commercial_general_en.pdf; ComponentLink1Description: https://product.tdk.com/info/en/catalog/datasheets/mlcc_commercial_general_en.pdf; Supplier Part Number 1: 445-1281-2-ND
C47 = 251R14S0R5BV4T: CAP CER 0.5PF 250V NP0 0603; Manufacturer: Johanson Technology Inc.; Tolerance: ±0.1pF; Temperature Coefficient: C0G, NP0; Supplier 1: Digi-Key; Manufacturer Part Number: 251R14S0R5BV4T; RoHS: RoHS Compliant; Category: Capacitors; Stock 1: 76000; Pricing 1: 4000=0.048, 8000=0.0456, 12000=0.0432, 28000=0.0408, 100000=0.0324 (USD); Packaging: Tape & Reel (TR); Part Status: Active; Capacitance: 0.5pF; Voltage - Rated: 250V; Operating Temperature: -55°C ~ 125°C; Features: High Q, Low Loss; Ratings: -; Applications: RF, Microwave, High Frequency; Mounting Type: Surface Mount, MLCC; Package / Case: 0603 (1608 Metric); Size / Dimension: 0.062" L x 0.032" W (1.57mm x 0.81mm); Height - Seated (Max): -; Thickness (Max): 0.035" (0.89mm); Lead Spacing: -; Lead Style: -; ComponentLink1URL: http://www.johansontechnology.com/downloads/JTI-CAT-MLCC-HighQ.pdf; ComponentLink1Description: http://www.johansontechnology.com/downloads/JTI-CAT-MLCC-HighQ.pdf; Supplier Part Number 1: 712-1168-2-ND
C48 = 251R14S1R3BV4T: CAP CER 1.3PF 250V NP0 0603; Manufacturer: Johanson Technology Inc.; Tolerance: ±0.1pF; Temperature Coefficient: C0G, NP0; Supplier 1: Digi-Key; Manufacturer Part Number: 251R14S1R3BV4T; RoHS: RoHS Compliant; Category: Capacitors; Stock 1: 4000; Pricing 1: 4000=0.048, 8000=0.0456, 12000=0.0432, 28000=0.0408, 100000=0.0324 (USD); Packaging: Tape & Reel (TR); Part Status: Active; Capacitance: 1.3pF; Voltage - Rated: 250V; Operating Temperature: -55°C ~ 125°C; Features: High Q, Low Loss; Ratings: -; Applications: RF, Microwave, High Frequency; Mounting Type: Surface Mount, MLCC; Package / Case: 0603 (1608 Metric); Size / Dimension: 0.062" L x 0.032" W (1.57mm x 0.81mm); Height - Seated (Max): -; Thickness (Max): 0.035" (0.89mm); Lead Spacing: -; Lead Style: -; ComponentLink1URL: http://www.johansontechnology.com/downloads/JTI-CAT-MLCC-HighQ.pdf; ComponentLink1Description: http://www.johansontechnology.com/downloads/JTI-CAT-MLCC-HighQ.pdf; Supplier Part Number 1: 712-1326-2-ND
C49 = 251R14S0R8BV4T: CAP CER 0.8PF 250V NP0 0603; Manufacturer: Johanson Technology Inc.; Tolerance: ±0.1pF; Temperature Coefficient: C0G, NP0; Supplier 1: Digi-Key; Manufacturer Part Number: 251R14S0R8BV4T; RoHS: RoHS Compliant; Category: Capacitors; Stock 1: 104000; Pricing 1: 4000=0.048, 8000=0.0456, 12000=0.0432, 28000=0.0408, 100000=0.0324 (USD); Packaging: Tape & Reel (TR); Part Status: Active; Capacitance: 0.8pF; Voltage - Rated: 250V; Operating Temperature: -55°C ~ 125°C; Features: High Q, Low Loss; Ratings: -; Applications: RF, Microwave, High Frequency; Mounting Type: Surface Mount, MLCC; Package / Case: 0603 (1608 Metric); Size / Dimension: 0.062" L x 0.032" W (1.57mm x 0.81mm); Height - Seated (Max): -; Thickness (Max): 0.035" (0.89mm); Lead Spacing: -; Lead Style: -; ComponentLink1URL: http://www.johansontechnology.com/downloads/JTI-CAT-MLCC-HighQ.pdf; ComponentLink1Description: http://www.johansontechnology.com/downloads/JTI-CAT-MLCC-HighQ.pdf; Supplier Part Number 1: 712-1305-2-ND
C51 C52 C56 = JMK107BJ475MAHT: as C1 on sheet Power_System; Supplier 1: Digi-Key; Manufacturer Part Number: JMK107BJ475MAHT; RoHS: RoHS Compliant; Category: Capacitors; Stock 1: 4000; Pricing 1: 4000=0.03053, 8000=0.0284, 12000=0.02698, 28000=0.02556, 100000=0.01935 (USD); Packaging: Tape & Reel (TR); Part Status: Active; Operating Temperature: -55°C ~ 85°C; Features: -; Ratings: AEC-Q200; Applications: Automotive, SMPS Filtering; Failure Rate: -; Mounting Type: Surface Mount, MLCC; Package / Case: 0603 (1608 Metric); Size / Dimension: 0.063" L x 0.031" W (1.60mm x 0.80mm); Height - Seated (Max): -; Thickness (Max): 0.035" (0.90mm); Lead Spacing: -; Lead Style: -; ComponentLink1URL: http://www.yuden.co.jp/productdata/catalog/en/mlcc_all_hq_e.pdf; ComponentLink1Description: http://www.yuden.co.jp/productdata/catalog/en/mlcc_all_hq_e.pdf; Supplier Part Number 1: 587-4903-2-ND
C57 C58 = EMK107BC6106MA-T: CAP CER 10uF; Manufacturer: Taiyo Yuden; Capacitance: 10µF; Tolerance: ±20%; Voltage - Rated: 16V; Temperature Coefficient: X6S; Supplier 1: Digi-Key; Manufacturer Part Number: EMK107BC6106MA-T; RoHS: RoHS Compliant; Category: Capacitors; Stock 1: 0; Pricing 1: 4000=0.08689, 8000=0.08178, 12000=0.07922, 28000=0.07667, 100000=0.06798 (USD); Packaging: Tape & Reel (TR); Part Status: Active; Operating Temperature: -55°C ~ 105°C; Features: -; Ratings: -; Applications: SMPS Filtering; Failure Rate: -; Mounting Type: Surface Mount, MLCC; Package / Case: 0603 (1608 Metric); Size / Dimension: 0.063" L x 0.031" W (1.60mm x 0.80mm); Height - Seated (Max): -; Thickness (Max): 0.039" (1.00mm); Lead Spacing: -; Lead Style: -; ComponentLink1URL: http://www.yuden.co.jp/productdata/catalog/en/mlcc06_e.pdf; ComponentLink1Description: http://www.yuden.co.jp/productdata/catalog/en/mlcc06_e.pdf; Supplier Part Number 1: 587-4867-2-ND
D3 = CLV1A-FKB-CJ1M1F1BB7R4S3: LED RED/GREEN/BLUE PLCC4 SMD; Manufacturer: Cree Inc; Color: Red, Green, Blue (RGB); Wavelength - Dominant: 621.5nm, 530nm, 472.5nm; Wavelength - Peak: 630nm, 527nm, 470nm; Millicandela Rating: 675mcd Red, 1055mcd Green, 337mcd Blue; Voltage - Forward (Vf) (Typ): 2V Red, 3.2V Green, 3.2V Blue; Current - Test: 20mA; Viewing Angle: 120°; Lens Type: Diffused, White; Lens Style/Size: Round with Flat Top, 2.2mm; Supplier 1: Digi-Key; Manufacturer Part Number: CLV1A-FKB-CJ1M1F1BB7R4S3; RoHS: RoHS Compliant; Category: Optoelectronics; Stock 1: 254000; Pricing 1: 2000=0.354, 50000=0.329, 100000=0.307 (USD); Packaging: Tape & Reel (TR); Package / Case: 4-PLCC; Size / Dimension: 3.20mm L x 2.80mm W; Height: 2.10mm; Mounting Type: Surface Mount; Luminous Flux @ Current - Test: -; ComponentLink1URL: http://www.cree.com/~/media/Files/Cree/LED%20Components%20and%20Modules/HB/Data%20Sheets/CLV1AFKB(874).pdf; ComponentLink1Description: http://www.cree.com/~/media/Files/Cree/LED%20Components%20and%20Modules/HB/Data%20Sheets/CLV1AFKB(874).pdf
L2 = LQG18HN3N3S00D: FIXED IND 3.3NH 500MA 150 MOHM; Manufacturer: Murata Electronics North America; Type: Multilayer; Material - Core: Air; Tolerance: ±0.3nH; Shielding: Unshielded; DC Resistance (DCR): 150 mOhm Max; Q @ Freq: 12 @ 100MHz; Frequency - Self Resonant: 6GHz; Frequency - Test: 100MHz; Supplier 1: Digi-Key; Manufacturer Part Number: LQG18HN3N3S00D; RoHS: RoHS Compliant; Category: Inductors, Coils, Chokes; Stock 1: 32000; Pricing 1: 4000=0.06714, 8000=0.06341, 12000=0.05968, 28000=0.05782, 100000=0.05409 (USD); Packaging: Tape & Reel (TR); Part Status: Active; Inductance: 3.3nH; Current Rating: 500mA; Current - Saturation: -; Ratings: -; Operating Temperature: -40°C ~ 85°C; Mounting Type: Surface Mount; Package / Case: 0603 (1608 Metric); Supplier Device Package: 0603 (1608 Metric); Size / Dimension: 0.063" L x 0.031" W (1.60mm x 0.80mm); Height - Seated (Max): 0.037" (0.95mm); ComponentLink1URL: http://search.murata.co.jp/Ceramy/image/img/P02/JELF243B-0002.pdf; ComponentLink1Description: http://search.murata.co.jp/Ceramy/image/img/P02/JELF243B-0002.pdf; Supplier Part Number 1: 490-1104-2-ND
L3 = L-14C1N8SV4T: FIXED IND 1.8NH 300MA 100 MOHM; Manufacturer: Johanson Technology Inc.; Type: Multilayer; Material - Core: Ceramic; Tolerance: ±0.3nH; Shielding: Unshielded; DC Resistance (DCR): 100 mOhm Max; Q @ Freq: 12 @ 100MHz; Frequency - Self Resonant: 23GHz; Frequency - Test: 100MHz; Supplier 1: Digi-Key; Manufacturer Part Number: L-14C1N8SV4T; RoHS: RoHS Compliant; Category: Inductors, Coils, Chokes; Stock 1: 16000; Pricing 1: 4000=0.02142, 8000=0.02023, 12000=0.01904, 28000=0.01845, 100000=0.01726 (USD); Packaging: Tape & Reel (TR); Part Status: Active; Inductance: 1.8nH; Current Rating: 300mA; Current - Saturation: -; Ratings: -; Operating Temperature: -40°C ~ 100°C; Mounting Type: Surface Mount; Package / Case: 0603 (1608 Metric); Supplier Device Package: 0603 (1608 Metric); Size / Dimension: 0.063" L x 0.031" W (1.60mm x 0.80mm); Height - Seated (Max): 0.037" (0.95mm); ComponentLink1URL: http://www.johansontechnology.com/downloads/jti-cat-rf-ind.pdf; ComponentLink1Description: http://www.johansontechnology.com/downloads/jti-cat-rf-ind.pdf; Supplier Part Number 1: 712-1426-2-ND
P1 = M50-3500542: CONN HDR 1.27MM VERT AU 10POS; Manufacturer: Harwin Inc; Connector Type: Unshrouded; Number of Positions: 10; Number of Positions Loaded: All; Pitch: 0.050" (1.27mm); Molding Height Above Board: 0.039" (1.00mm); Supplier 1: Digi-Key; Manufacturer Part Number: M50-3500542; RoHS: RoHS Compliant; Category: Connectors, Interconnects; Stock 1: 16006; Pricing 1: 1=1.16, 10=1.017, 25=0.9576, 50=0.9178, 100=0.8778, 250=0.798, 500=0.7182, 1000=0.6384, 2500=0.57855 (USD); Packaging: Bulk; Number of Rows: 2; Row Spacing: 0.050" (1.27mm); Height Stacking (Mating): -; Contact Mating Length: 0.118" (3.00mm); Mounting Type: Through Hole; Termination: Solder; Contact Finish: Gold; Contact Finish Thickness: 5.9µin (0.15µm); Features: -; Color: Black; ComponentLink1URL: http://harwin.com/includes/pdfs/M50-350.pdf; ComponentLink1Description: http://harwin.com/includes/pdfs/M50-350.pdf
P3 = Header 3: Header, 3-Pin; LatestRevisionDate: 17-Jul-2002; LatestRevisionNote: Re-released for DXP Platform.; Publisher: Altium Limited
R15 = TNPW06033K57BEEA: as R4 on sheet Power_System; Supplier 1: Digi-Key; Manufacturer Part Number: TNPW06033K57BEEA; RoHS: RoHS Compliant; Category: Resistors; Stock 1: 0; Pricing 1: 5000=0.1064 (USD); Packaging: Tape & Reel (TR); Part Status: Active; Resistance (Ohms): 3.57k; Tolerance: ±0.1%; Composition: Thin Film; Features: Anti-Sulfur, Automotive AEC-Q200, Moisture Resistant; Operating Temperature: -55°C ~ 125°C; Package / Case: 0603 (1608 Metric); Supplier Device Package: 0603; Size / Dimension: 0.063" L x 0.033" W (1.60mm x 0.85mm); Height - Seated (Max): 0.022" (0.55mm); Number of Terminations: 2; Failure Rate: -; ComponentLink1URL: http://www.vishay.com/docs/28758/tnpw_e3.pdf; ComponentLink1Description: http://www.vishay.com/docs/28758/tnpw_e3.pdf; Supplier Part Number 1: TNPW06033K57BEEA-ND
R16-R18 = RC0603JR-07330RL: RES SMD 330 OHM 5% 1/10W 0603; Manufacturer: Yageo; Power (Watts): 0.1W, 1/10W; Temperature Coefficient: ±100ppm/°C; Supplier 1: Digi-Key; Manufacturer Part Number: RC0603JR-07330RL; RoHS: RoHS Compliant; Category: Resistors; Stock 1: 1380000; Pricing 1: 5000=0.00129, 10000=0.00112, 25000=0.00099, 50000=0.0009, 125000=0.00089 (USD); Packaging: Tape & Reel (TR); Part Status: Active; Resistance (Ohms): 330; Tolerance: ±5%; Composition: Thick Film; Features: Moisture Resistant; Operating Temperature: -55°C ~ 155°C; Package / Case: 0603 (1608 Metric); Supplier Device Package: 0603; Size / Dimension: 0.063" L x 0.031" W (1.60mm x 0.80mm); Height - Seated (Max): 0.022" (0.55mm); Number of Terminations: 2; Failure Rate: -; ComponentLink1URL: http://www.yageo.com/documents/recent/PYu-RC_Group_51_RoHS_L_6.pdf; ComponentLink1Description: http://www.yageo.com/documents/recent/PYu-RC_Group_51_RoHS_L_6.pdf; Supplier Part Number 1: 311-330GRTR-ND
R19 = PHT0603Y1002BGT200: as R8 on sheet Power_System; Supplier 1: Digi-Key; Manufacturer Part Number: PHT0603Y1002BGT200; RoHS: RoHS Compliant; Category: Resistors; Stock 1: 400; Pricing 1: 200=6.6496, 400=6.0262, 600=5.6106, 1000=5.195 (USD); Packaging: Tape & Reel (TR); Part Status: Active; Resistance (Ohms): 10k; Tolerance: ±0.1%; Power (Watts): 0.0375W; Composition: Thin Film; Features: Anti-Sulfur; Operating Temperature: -55°C ~ 215°C; Package / Case: 0603 (1608 Metric); Supplier Device Package: 0603; Size / Dimension: 0.060" L x 0.033" W (1.52mm x 0.85mm); Height - Seated (Max): 0.025" (0.64mm); Number of Terminations: 2; Failure Rate: -; ComponentLink1URL: http://www.vishay.com/docs/53050/pht.pdf; ComponentLink1Description: http://www.vishay.com/docs/53050/pht.pdf; Supplier Part Number 1: PHTB-10KTR-ND
SW1 = EVQ-PE105K: SWITCH TACTILE SPST-NO 0.05A 12V; Manufacturer: Panasonic Electronic Components; Switch Function: Off-Mom; Contact Rating @ Voltage: 0.05A @ 12VDC; Actuator Type: Standard; Actuator Height off PCB, from Pins: 5.00mm; Actuator Orientation: Top Actuated; Outline: 6.00mm x 3.50mm; Illumination: Non-Illuminated; Operating Force: 100gf; Switch Travel: 0.25mm; Mechanical Life: 50,000 Cycles; Supplier 1: Digi-Key; Manufacturer Part Number: EVQ-PE105K; RoHS: RoHS Compliant; Category: Switches; Stock 1: 18000; Pricing 1: 2000=0.32832, 4000=0.3078, 6000=0.29754, 10000=0.27702, 14000=0.27292, 50000=0.26676 (USD); Packaging: Tape & Reel (TR); Circuit: SPST-NO; Mounting Type: Surface Mount; Termination Style: Gull Wing; Illumination Voltage (Nominal): -; Illumination Type, Color: -; Ingress Protection: -; Features: -; Actuator Material: -; Operating Temperature: -30°C ~ 85°C; ComponentLink1URL: http://www.panasonic.com/industrial/components/pdf/ATK0000CE7.pdf; ComponentLink1Description: http://www.panasonic.com/industrial/components/pdf/ATK0000CE7.pdf
U5 = 0479480001: ANTENNA 2.4GHZ 50 OHMS SMD; Manufacturer: Molex, LLC; Frequency Group: UHF (2 GHz ~ 3 GHz); Frequency Range: 2.4GHz ~ 2.483.5GHz; Antenna Type: Chip; Number of Bands: 1; Return Loss: -9dB; Gain: 3dBi; Power - Max: 2W; Supplier 1: Digi-Key; Manufacturer Part Number: 0479480001; RoHS: RoHS Compliant; Category: RF/IF and RFID; Stock 1: 3600; Pricing 1: 1800=0.73695, 3600=0.68782, 5400=0.65343, 12600=0.62886, 45000=0.60921, 90000=0.58956 (USD); Packaging: Tape & Reel (TR); Part Status: Active; Frequency (Center/Band): 2.4GHz; VSWR: -; Features: -; Termination: Solder; Ingress Protection: -; Mounting Type: Surface Mount; Height (Max): 0.157" (4.00mm); Applications: Bluetooth, WLAN, Zigbee™; ComponentLink1URL: http://www.molex.com/pdm_docs/sd/479480001_sd.pdf; ComponentLink1Description: http://www.molex.com/pdm_docs/sd/479480001_sd.pdf; Supplier Part Number 1: WM4893TR-ND
U6 = nRF52840_QIAA: Multi-protocol Bluetooth Low Energy, IEEE 802.15.4, ANT and 2.4GHz proprietary system-on-chip; Part Number: nRF52840-QIAAAA; LatestRevisionDate: 2016-11-22; Pin Count: 73; Publisher: Nordic Semiconductor; Published: 2016-06-22; Value: nRF52840-QIAA; Note: *; Footprint Doc: AQFN-73
X2 = XTAL_SMD2016: XTAL SMD 2016, 32MHz, Cl=8pF, Total Tol: ±40ppm; Part Number: XTAL_SMD2016_32MHz_8pF_General; LatestRevisionDate: 2016-08-19; Pin Count: 4; Publisher: Nordic Semiconductor; Published: 2016-08-19; Value: 32MHz; Footprint Doc: XTAL_2016
X3 = XTAL_SMD3215: XTAL SMD 3215, 32.768kHz, Cl=9pF, Total Tol: ±50ppm; Part Number: XTAL_SMD3215_32.768kHz_9pF_General; LatestRevisionDate: 2016-08-19; Pin Count: 2; Publisher: Nordic Semiconductor; Published: 2016-08-19; Value: 32.768kHz; Footprint Doc: XTAL_3215